# EAGLE design pad2console (EAGLE 7.2.0)
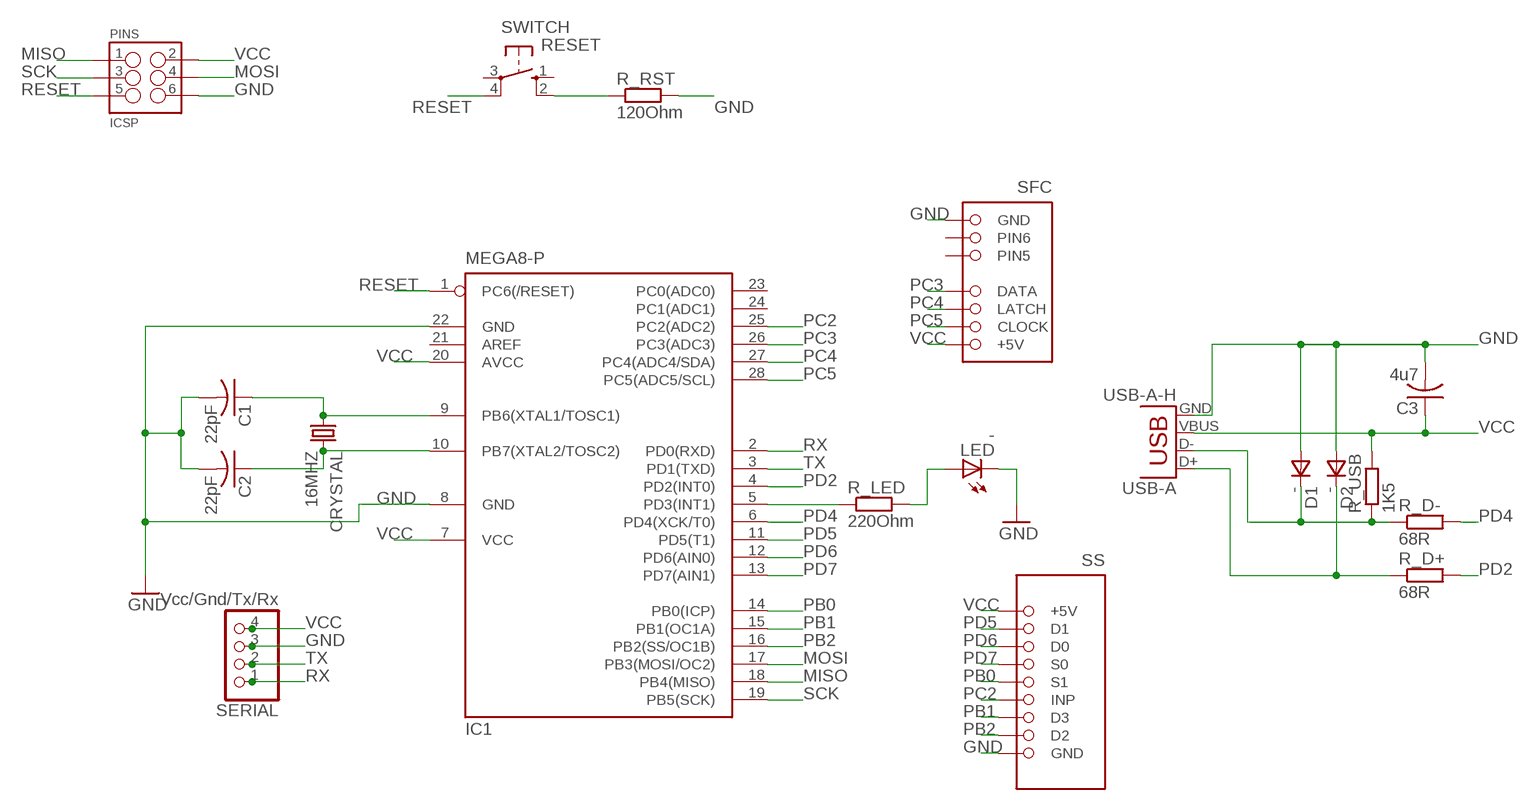
[diagram p0: schematic, sheet 1]

## Parts
C1  22pF  C-US050-024X044  [C050-024X044]
C2  22pF  C-US050-024X044  [C050-024X044]
C3  4u7  C-US050-024X044  [C050-024X044]
CRYSTAL  16MHZ  CRYSTALHC49S  [HC49/S]
D1  -  D_E2L  [E2LINE]
D2  -  D_E2L  [E2LINE]
IC1  MEGA8-P  [DIL28-3]
LED  -  LEDLD260  [LD260]
PINS  ICSP  M03X2SHROUD  [2X3-SHROUDED]
R_D+  68R  R-EU_0204/5  [0204/5]
R_D-  68R  R-EU_0204/5  [0204/5]
R_LED  220Ohm  R-EU_0204/5  [0204/5]
R_RST  120Ohm  R-EU_0204/5  [0204/5]
R_USB  1K5  R-EU_0204/5  [0204/5]
SERIAL  Vcc/Gnd/Tx/Rx  PINHD-1X4  [1X04]
SFC  SFC_PIN  [SFC_PIN]
SS  SS_PIN  [SS_PIN]
SWITCH  RESET  10-XX  [B3F-10XX]
USB-A  USB-A-H  [USB-A-H]

## Nets
D+: D2.1(C) R_D+.1 USB-A.D+
D-: D1.1(C) R_D-.1 R_USB.1 USB-A.D-
GND: C1.2 C2.2 C3.2 D1.2(A) D2.2(A) IC1.8(GND) IC1.22(GND) LED.K(C) PINS.6 R_RST.2 SERIAL.3 SFC.PIN7(GND) SS.PIN9(GND) USB-A.GND
MISO: IC1.18(PB4(MISO)) PINS.1
MOSI: IC1.17(PB3(MOSI/OC2)) PINS.4
N$37: LED.A R_LED.2
N$49: R_RST.1 SWITCH.2(S1)
PB0: IC1.14(PB0(ICP)) SS.PIN5(S1)
PB1: IC1.15(PB1(OC1A)) SS.PIN7(D3)
PB2: IC1.16(PB2(SS/OC1B)) SS.PIN8(D2)
PB6: C1.1 CRYSTAL.1 IC1.9(PB6(XTAL1/TOSC1))
PB7: C2.1 CRYSTAL.2 IC1.10(PB7(XTAL2/TOSC2))
PC2: IC1.25(PC2(ADC2)) SS.PIN6(INP)
PC3: IC1.26(PC3(ADC3)) SFC.PIN4(DATA)
PC4: IC1.27(PC4(ADC4/SDA)) SFC.PIN3(LATCH)
PC5: IC1.28(PC5(ADC5/SCL)) SFC.PIN2(CLOCK)
PD2: IC1.4(PD2(INT0)) R_D+.2
PD3: IC1.5(PD3(INT1)) R_LED.1
PD4: IC1.6(PD4(XCK/T0)) R_D-.2
PD5: IC1.11(PD5(T1)) SS.PIN2(D1)
PD6: IC1.12(PD6(AIN0)) SS.PIN3(D0)
PD7: IC1.13(PD7(AIN1)) SS.PIN4(S0)
RESET: IC1.1(PC6(/RESET)) PINS.5 SWITCH.4(P1)
RX: IC1.2(PD0(RXD)) SERIAL.1
SCK: IC1.19(PB5(SCK)) PINS.3
TX: IC1.3(PD1(TXD)) SERIAL.2
VCC: C3.1 IC1.7(VCC) IC1.20(AVCC) PINS.2 R_USB.2 SERIAL.4 SFC.PIN1(+5V) SS.PIN1(+5V) USB-A.VBUS
Unconnected: IC1.21(AREF) IC1.23(PC0(ADC0)) IC1.24(PC1(ADC1)) SFC.PIN5 SFC.PIN6 SS.G1 SS.G2 SWITCH.1(S) SWITCH.3(P)

## Library data of the parts
C1-C3 = rcl:C-US: CAPACITOR, American symbol
CRYSTAL = crystal:CRYSTAL: CRYSTAL; OC_FARNELL: 1667008; OC_NEWARK: unknown
D1 D2 = zetex:D_E2L: DIODE; OC_FARNELL: unknown; OC_NEWARK: unknown
IC1 = atmel:MEGA8-P: MICROCONTROLLER 8 Kbytes FLASH, 1 kbytes SRAM, 512 bytes EEPROM, USART, 4-channel 10 bit ADC, 2-channel 8 bit ADC Pin compatible with Atmega48, ATMega88, ATMega168 Source: avr.lbr; OC_FARNELL: unknown; OC_NEWARK: unknown
LED = led:LED: LED OSRAM: - CHIPLED LG R971, LG N971, LY N971, LG Q971, LY Q971, LO R971, LY R971 LH N974, LH R974 LS Q976, LO Q976, LY Q976 LO Q996 - Hyper CHIPLED LW Q18S LB Q993, LB Q99A, LB R99A - SideLED LS A670, LO A670, LY A670, LG A670, LP A670 LB A673, LV A673, LT A673, LW A673 LH A674 LY A675 LS A676, LA A676, LO A676, LY A676, LW A676 LS A679, LY A679, LG A679 - Hyper Micro SIDELED® LS Y876, LA Y876, LO Y876, LY Y876 LT Y87S - SmartLED LW L88C, LW L88S LB L89C, LB L89S, LG L890 LS L89K, LO L89K, LY L89K LS L896, LA L896, LO L896, LY L896 - TOPLED LS T670, LO T670, LY T670, LG T670, LP T670 LSG T670, LSP T670, LSY T670, LOP T670, LYG T670 LG T671, LOG T671, LSG T671 LB T673, LV T673, LT T673, LW T673 LH T674 LS T676, LA T676, LO T676, LY T676, LB T676, LH T676, LSB T676, LW T676 LB T67C, LV T67C, LT T67C, LS T67K, LO T67K, LY T67K, LW E67C LS E67B, LA E67B, LO E67B, LY E67B, LB E67C, LV E67C, LT E67C LW T67C LS T679, LY T679, LG T679 LS T770, LO T770, LY T770, LG T770, LP T770 LB T773, LV T773, LT T773, LW T773 LH T774 LS E675, LA E675, LY E675, LS T675 LS T776, LA T776, LO T776, LY T776, LB T776 LHGB T686 LT T68C, LB T68C - Hyper Mini TOPLED® LB M676 - Mini TOPLED Santana® LG M470 LS M47K, LO M47K, LY M47K Source: http://www.osram.convergy.de LUXEON: - LUMILED® LXK2-PW12-R00, LXK2-PW12-S00, LXK2-PW14-U00, LXK2-PW14-V00 LXK2-PM12-R00, LXK2-PM12-S00, LXK2-PM14-U00 LXK2-PE12-Q00, LXK2-PE12-R00, LXK2-PE12-S00, LXK2-PE14-T00, LXK2-PE14-U00 LXK2-PB12-K00, LXK2-PB12-L00, LXK2-PB12-M00, LXK2-PB14-N00, LXK2-PB14-P00, LXK2-PB14-Q00 LXK2-PR12-L00, LXK2-PR12-M00, LXK2-PR14-Q00, LXK2-PR14-R00 LXK2-PD12-Q00, LXK2-PD12-R00, LXK2-PD12-S00 LXK2-PH12-R00, LXK2-PH12-S00 LXK2-PL12-P00, LXK2-PL12-Q00, LXK2-PL12-R00 Source: www.luxeon.com KINGBRIGHT: KA-3528ASYC Source: www.kingbright.com
PINS = SparkFun-Connectors:M03X2: 2x3 .1" header. Shrouded, with keying- CONN-10681 SMT- CONN-11415 Pogo pins- HW-11044; PROD_ID: CONN-10681
R_D+ R_D- R_LED R_RST R_USB = resistor:R-EU_: RESISTOR, European symbol
SERIAL = pinhead:PINHD-1X4: PIN HEADER
SFC = minid:SFC_PIN
SS = minid:SS_PIN
SWITCH = switch-omron:10-XX: OMRON SWITCH; MPN: B3F-1000; OC_FARNELL: 176432; OC_NEWARK: 36M3542
USB-A = SparkFun-Connectors:USB: USB Connectors USB-B-PTH is fully proven SKU : PRT-00139/CONN-08278 USB-miniB is fully proven SKU : PRT-00587 USB-A-PCB is untested. USB-A-H is throughly reviewed, but untested. Spark Fun Electronics SKU : PRT-00437 USB-B-SMT is throughly reviewed, but untested. Needs silkscreen touching up. USB-A-S has not been used/tested USB-MB-H has not been used/tested USB-MICROB has been used. CONN-09505; PROD_ID: CONN-08367

## Board
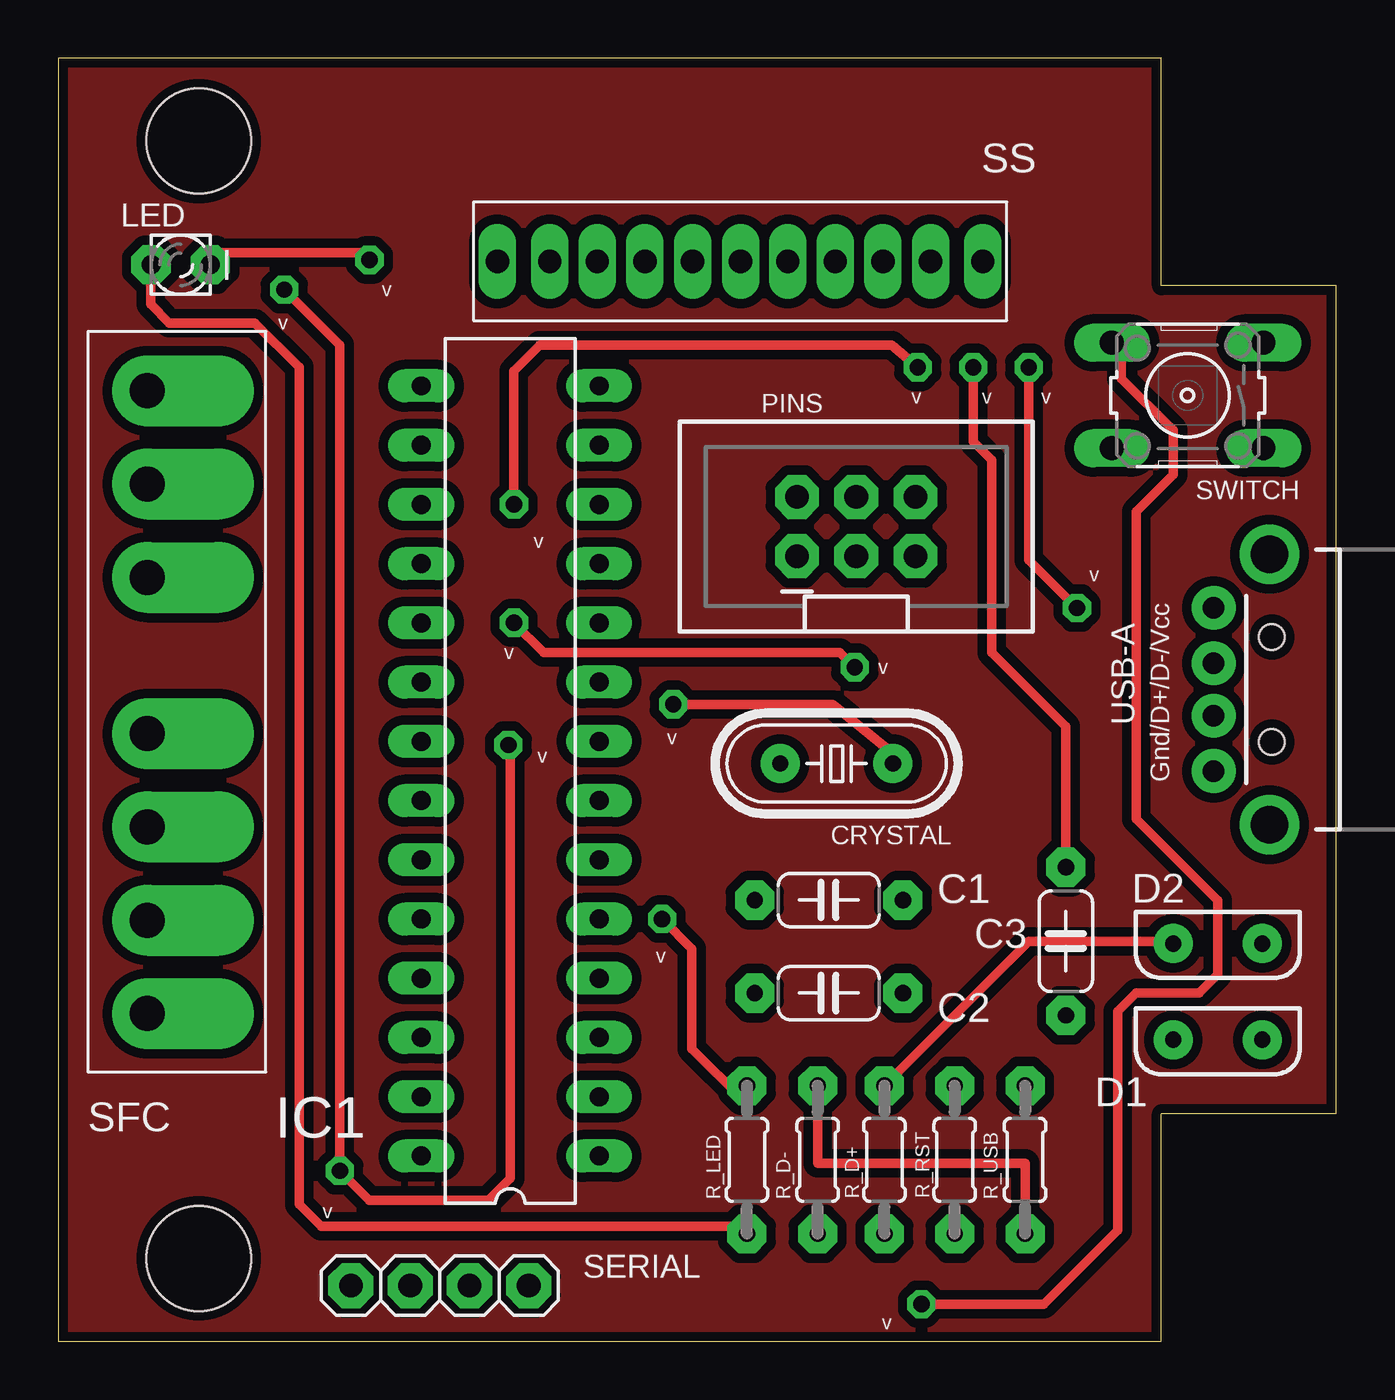
[diagram p1: board, top side]
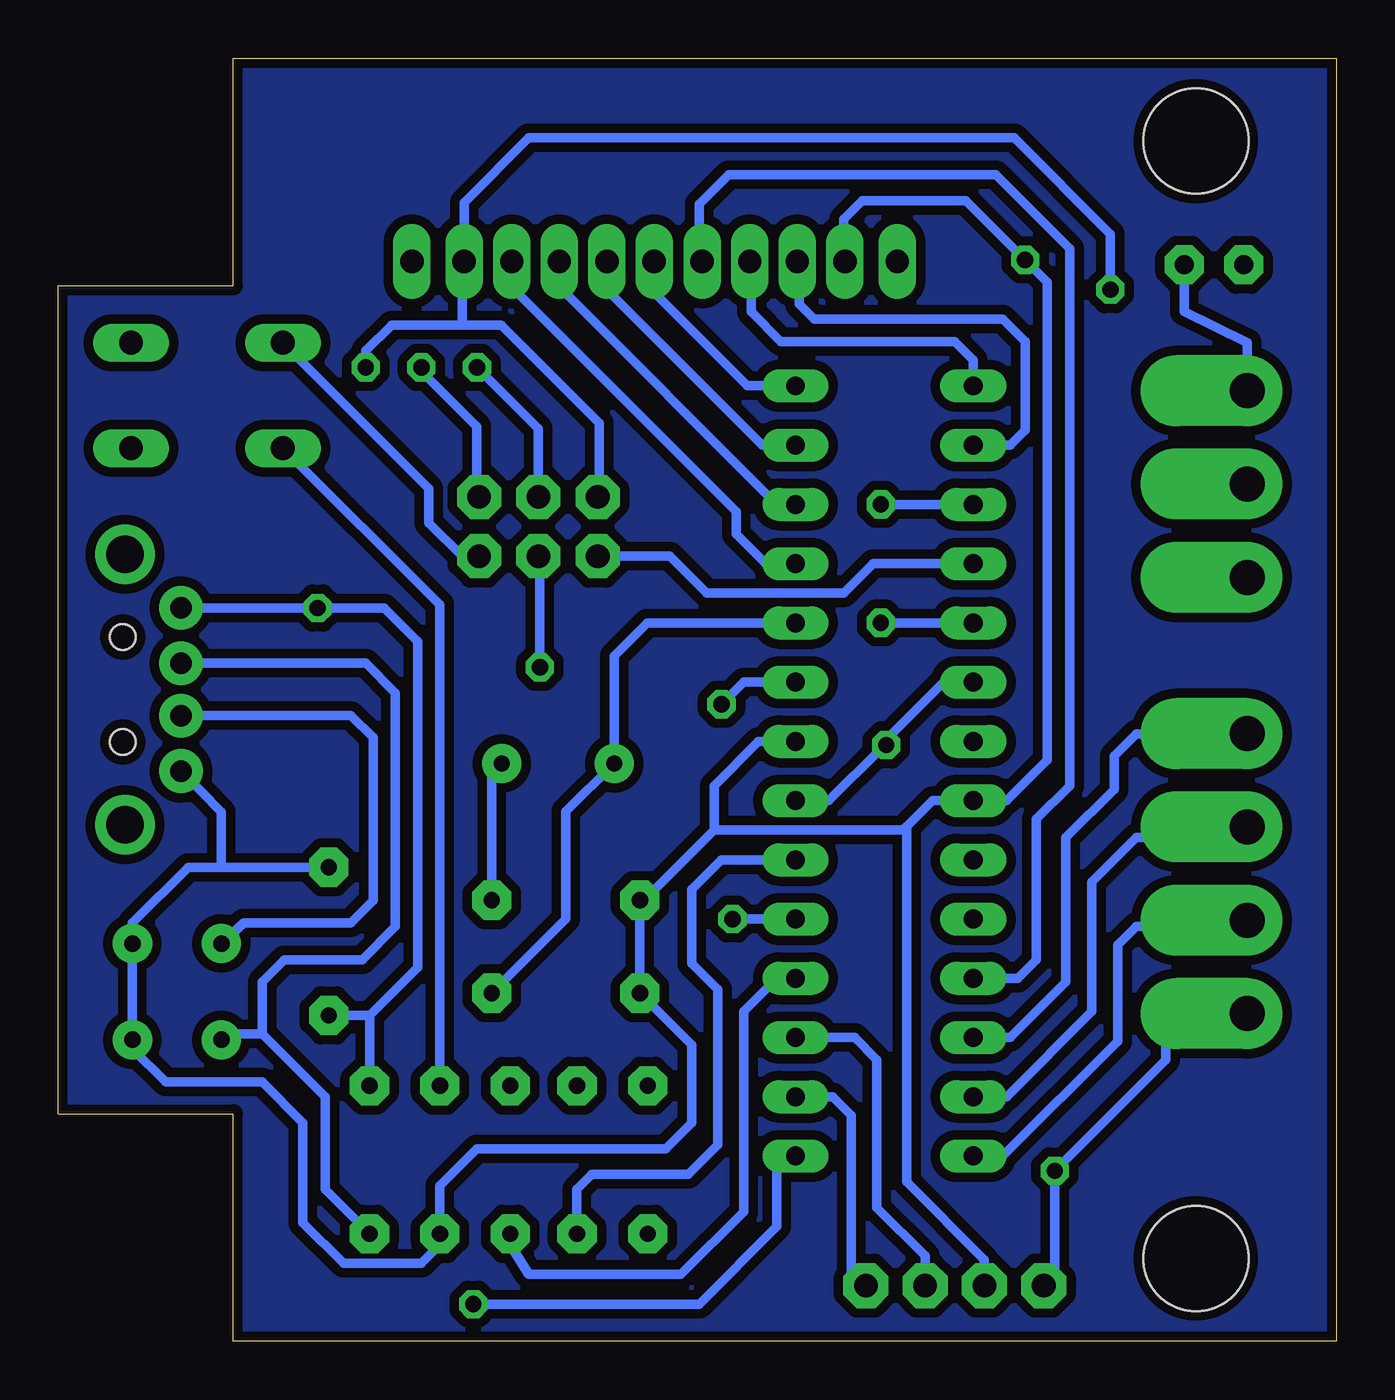
[diagram p2: board, bottom side, seen from below]

Size 54.77 x 55 mm. Coordinates in mm from the lower left corner, seen from the top.
Outline: 0,0 47.27,0 47.27,9.75 54.77,9.75 54.77,45.25 47.27,45.25 47.27,55 0,55 0,0
Copper layers (1*16): Top 0.035mm / dielectric 1.5mm / Bottom 0.035mm
Design rules "SparkFun": minimum track width 8mil, minimum drill 20mil, track to track 8mil, track to pad 8mil, pad to pad 8mil, via to via 8mil, smd to smd 8mil, copper to edge 8mil, drill to drill 8mil, minimum pad ring 12mil, minimum via ring 10mil, stop-mask expansion 4mil, vias tented up to drill 20mil, thermal gap 10mil
Holes 4.5 mm at 6.02,51.45 6.02,3.55

### Footprints (pad centres in the part's own frame; a part is rotated, then mirrored left to right if it is on the bottom)
C050-024X044 = drill 0.7 pad 1.676 octagon: 1 -3.175,0; 2 3.175,0
HC49/S = drill 0.7 pad 1.676: 1 -2.413,0; 2 2.413,0
E2LINE = drill 0.7 pad 1.676: 1 0.254,-2.54; 2 0.254,1.27
DIL28-3 = drill 0.813 long: 1 -16.51,-3.81; 2 -13.97,-3.81; 3 -11.43,-3.81; 4 -8.89,-3.81; 5 -6.35,-3.81; 6 -3.81,-3.81; 7 -1.27,-3.81; 8 1.27,-3.81; 9 3.81,-3.81; 10 6.35,-3.81; 11 8.89,-3.81; 12 11.43,-3.81; 13 13.97,-3.81; 14 16.51,-3.81; 15 16.51,3.81; 16 13.97,3.81; 17 11.43,3.81; 18 8.89,3.81; 19 6.35,3.81; 20 3.81,3.81; 21 1.27,3.81; 22 -1.27,3.81; 23 -3.81,3.81; 24 -6.35,3.81; 25 -8.89,3.81; 26 -11.43,3.81; 27 -13.97,3.81; 28 -16.51,3.81
LD260 = drill 0.813 pad 1.676 octagon: A -1.27,0; K 1.27,0
2X3-SHROUDED = drill 1.016 pad 1.88 octagon: 1 -1.27,2.54; 2 1.27,2.54; 3 -1.27,0; 4 1.27,0; 5 -1.27,-2.54; 6 1.27,-2.54
0204/5 = drill 0.7 pad 1.676 octagon: 1 -3.175,0; 2 3.175,0
1X04 = drill 1.016 pad 1.93 octagon: 1 -3.81,0; 2 -1.27,0; 3 1.27,0; 4 3.81,0
SFC_PIN = drill 1.5 pad 3.048 offset: PIN1 26.7,0.01; PIN2 22.7,0.01; PIN3 18.7,0.01; PIN4 14.7,0.01; PIN5 8,0.01; PIN6 4,0.01; PIN7 0,0.01
SS_PIN = drill 1 long: G1 -10.4,0; G2 10.4,0; PIN1 -8.16,0; PIN2 -6.12,0; PIN3 -4.08,0; PIN4 -2.04,0; PIN5 -0.02,0; PIN6 2.04,0; PIN7 4.08,0; PIN8 6.12,0; PIN9 8.16,0
B3F-10XX = drill 1.016 long: 1 -3.251,2.261; 2 3.251,2.261; 3 -3.251,-2.261; 4 3.251,-2.261
USB-A-H = drill 0.914 pad 1.88: D+ 2.4,1.127; D- 2.4,-1.127; GND 2.4,3.5; VBUS 2.4,-3.5 | drill 1.6 pad 2.54: GND2 0,-5.8; GND3 0,5.8 | hole 1.1: -0.1,2.25; -0.1,-2.25

### Placement (x,y rotation side)
C1  33.02,18.91 180 top
C2  33.02,14.92 180 top
C3  43.18,17.14 90 top
CRYSTAL  33.35,24.77 180 top
D1  50.32,13.18 270 top
D2  50.32,17.3 270 top
IC1  19.37,24.45 90 top
LED  5.24,46.15 0 top
PINS  34.2,34.92 90 top
R_D+  35.4,7.78 270 top
R_D-  32.54,7.78 270 top
R_LED  29.51,7.78 270 top
R_RST  38.42,7.78 270 top
R_USB  41.43,7.78 90 top
SERIAL  16.35,2.38 180 top
SFC  3.81,40.75 270 top
SS  29.22,46.3 180 top
SWITCH  48.4,40.55 180 top
USB-A  51.91,27.94 180 top

### Tracks (layer width: path | path; a pad name or v marks a point on that pad's centre or on a via)
D+
  Top 0.406: R_D+.1 41.59,17.14 47.94,17.14 D2.1
  Bottom 0.406: D2.1 46.83,17.94 42.23,17.94 41.27,18.89 41.27,25.88 42.23,26.83 49.53,26.83 USB-A.D+
D-
  Top 0.406: R_D-.1 32.54,7.62 41.43,7.62 R_USB.1
  Bottom 0.406: R_USB.1 43.34,6.51 43.34,10.48 46.04,13.18 | 46.04,13.18 46.04,15.4 45.09,16.35 41.75,16.35 40.32,17.78 40.32,27.78 41.59,29.07 USB-A.D- | D1.1 47.47,13.18 46.04,13.18
GND  (via drill 0.7)
  Top 0.406: C3.2 43.18,26.35 40.01,29.53 40.01,37.78 39.21,38.58 v39.21,41.75 | LED.K 7.04,46.67 13.02,46.67 v13.34,46.35
  Bottom 0.254: SS.PIN9 21.11,46.3
  Bottom 0.406: IC1.8 24.77,25.72 26.67,23.81 26.67,21.91 | 21.11,46.3 21.11,48.1 20.32,48.9 15.88,48.9 v13.34,46.35 12.38,45.4 12.38,24.92 14.13,23.18 IC1.22 17.3,23.18 18.41,22.07 | SFC.PIN7 3.82,42.82 6.51,44.14 LED.K | 18.41,22.07 18.41,6.83 15.08,3.49 SERIAL.3 14.76,1.91 | 47.78,20.32 49.21,20.32 51.59,17.94 D2.2 D1.2 51.59,12.54 50.16,11.11 46.04,11.11 44.29,9.37 44.29,5.08 42.55,3.33 39.21,3.33 38.42,4.13 R_RST.2 38.42,6.67 36.83,8.26 28.73,8.26 27.62,9.37 27.62,12.7 C2.2 C1.2 29.67,18.91 26.67,21.91 | 47.78,20.32 C3.2 | USB-A.GND 47.78,22.69 47.78,20.32 | PINS.6 36.83,37.15 36.83,39.21 39.21,41.59 v39.21,41.75 | 18.41,22.07 18.57,21.91 26.67,21.91
MISO
  Bottom 0.406: IC1.18 19.84,33.34 21.11,32.07 26.99,32.07 28.57,33.66 PINS.1
MOSI  (via drill 0.7)
  Top 0.406: v36.83,41.75 35.72,42.7 20.64,42.7 19.53,41.59 v19.53,35.88
  Bottom 0.406: v19.53,35.88 IC1.17 | PINS.4 34.2,39.12 v36.83,41.75
N$3
  pour Top (isolate 0.406): 0,0 47.31,0 47.31,9.68 54.77,9.68 54.77,45.24 47.31,45.24 47.31,54.93 0,54.93
N$5
  pour Bottom (isolate 0.406): 0,0 47.47,0 47.47,9.68 54.77,9.68 54.77,45.24 47.31,45.24 47.31,54.93 0,54.93
N$37
  Top 0.406: LED.A 3.97,45.83 3.97,44.45 4.76,43.66 8.41,43.66 10.32,41.75 10.32,5.87 11.27,4.92 29.21,4.92 R_LED.2 29.37,5.24
N$49
  Bottom 0.406: R_RST.1 38.42,31.59 SWITCH.2
PB0
  Bottom 0.254: SS.PIN5 29.21,46.3
  Bottom 0.406: 29.21,46.3 29.21,44.93 25.24,40.96 IC1.14
PB1
  Bottom 0.254: SS.PIN7 25.08,46.3
  Bottom 0.406: 25.08,46.3 25.08,44.13 23.81,42.86 16.35,42.86 15.56,42.07 IC1.15
PB2
  Bottom 0.254: 23.02,46.3 SS.PIN8
  Bottom 0.406: IC1.16 13.97,38.42 13.34,39.05 13.34,42.86 14.29,43.81 22.38,43.81 23.02,44.45 23.02,46.3
PB6  (via drill 0.7)
  Top 0.406: v26.35,27.3 33.18,27.3 35.72,25.24 CRYSTAL.1
  Bottom 0.406: IC1.9 25.4,28.26 v26.35,27.3 | CRYSTAL.1 36.2,24.29 C1.1
PB7
  Bottom 0.406: C2.1 33.02,18.1 33.02,22.7 CRYSTAL.2 30.94,29.37 29.53,30.8 IC1.10
PC2
  Bottom 0.254: SS.PIN6 27.3,46.3
  Bottom 0.406: 27.3,46.3 27.3,48.74 26.04,50.01 14.61,50.01 11.43,46.83 11.43,23.81 12.86,22.38 12.86,16.35 13.65,15.56 IC1.25
PC3
  Bottom 0.254: 3.82,26.04 SFC.PIN4
  Bottom 0.406: IC1.26 13.97,13.02 11.59,15.4 11.59,21.59 9.53,23.65 9.53,25.08 8.57,26.04 3.82,26.04
PC4
  Bottom 0.254: 3.82,21.59 SFC.PIN3
  Bottom 0.406: IC1.27 14.13,10.48 10.48,14.13 10.48,19.68 8.57,21.59 3.82,21.59
PC5
  Bottom 0.254: 3.82,17.78 SFC.PIN2
  Bottom 0.406: IC1.28 14.29,7.94 9.37,12.86 9.37,16.99 8.57,17.78 3.82,17.78
PD2
  Bottom 0.406: IC1.4 23.97,15.56 25.4,14.13 25.4,5.56 28.1,2.86 34.61,2.86 35.4,4.13 R_D+.2
PD3  (via drill 0.7)
  Top 0.406: v25.88,18.1 27.15,16.83 27.15,12.54 29.35,10.34 R_LED.1
  Bottom 0.406: v25.88,18.1 IC1.5
PD4
  Bottom 0.406: IC1.6 26.35,20.64 27.62,19.37 27.62,16.19 26.51,15.08 26.51,8.41 27.78,7.14 31.91,7.14 32.54,6.51 R_D-.2
PD5
  Bottom 0.254: SS.PIN2 35.4,46.3
  Bottom 0.406: SS.PIN2 35.4,46.24 35.4,45.24 25.72,35.56 25.72,34.61 24.45,33.34 IC1.11
PD6
  Bottom 0.254: SS.PIN3 33.34,46.3
  Bottom 0.406: SS.PIN3 33.34,46.26 33.34,45.24 23.97,35.88 IC1.12
PD7
  Bottom 0.254: SS.PIN4 31.27,46.3
  Bottom 0.406: IC1.13 24.61,38.42 31.27,45.09 31.27,46.29 SS.PIN4
RESET  (via drill 0.7)
  Top 0.406: v36.99,1.59 42.23,1.59 45.4,4.76 45.4,14.13 46.2,14.92 48.9,14.92 49.69,15.72 49.69,18.89 46.2,22.38 46.2,35.56 47.78,37.15 47.78,39.06 45.56,41.27 45.56,42.17 SWITCH.4
  Bottom 0.406: PINS.5 37.47,33.66 38.89,35.08 38.89,36.55 SWITCH.4 | IC1.1 23.97,7.94 23.97,4.92 27.3,1.59 v36.99,1.59
RX
  Bottom 0.406: IC1.2 21.59,10.48 20.8,9.68 20.8,2.7 20.32,2.22 SERIAL.1
SCK  (via drill 0.7)
  Top 0.406: v19.53,30.8 20.8,29.53 33.5,29.53 v34.13,28.89
  Bottom 0.406: IC1.19 v19.53,30.8 | PINS.3 34.13,33.66 v34.13,28.89
TX
  Bottom 0.406: IC1.3 20.64,13.02 19.68,12.06 19.68,5.71 17.62,3.65 SERIAL.2
VCC  (via drill 0.7)
  Top 0.406: v9.68,45.09 12.06,42.7 v12.06,7.3 13.34,6.03 18.41,6.03 19.37,6.99 19.37,25.4 v19.29,25.56 | v43.66,31.43 41.59,33.5 v41.59,41.75
  Bottom 0.406: v9.68,45.09 9.68,47.47 13.81,51.59 34.61,51.59 37.38,48.81 SS.PIN1 37.47,46.3 37.47,43.57 | C3.1 41.43,13.97 | 41.43,13.97 39.37,16.03 39.37,30 40.8,31.43 v43.66,31.43 USB-A.VBUS | SERIAL.4 12.06,2.86 v12.06,7.3 7.3,12.06 7.3,13.97 SFC.PIN1 | 37.47,43.57 35.79,43.57 31.59,39.37 31.59,36.2 PINS.2 | IC1.20 16.83,28.26 19.21,25.88 19.21,25.64 v19.29,25.56 19.37,25.48 19.53,25.4 21.75,23.18 IC1.7 | R_USB.2 41.43,13.97 | 37.47,43.57 40.48,43.57 41.59,42.46 v41.59,41.75 | 49.53,31.43 USB-A.VBUS | USB-A.VBUS

### Text on the board
tNames: v | v | v | v | v | v | v | v | v | v | v | Gnd/D+/D-/Vcc | v | v | v